# EAGLE design M307A (EAGLE 6.6.0)
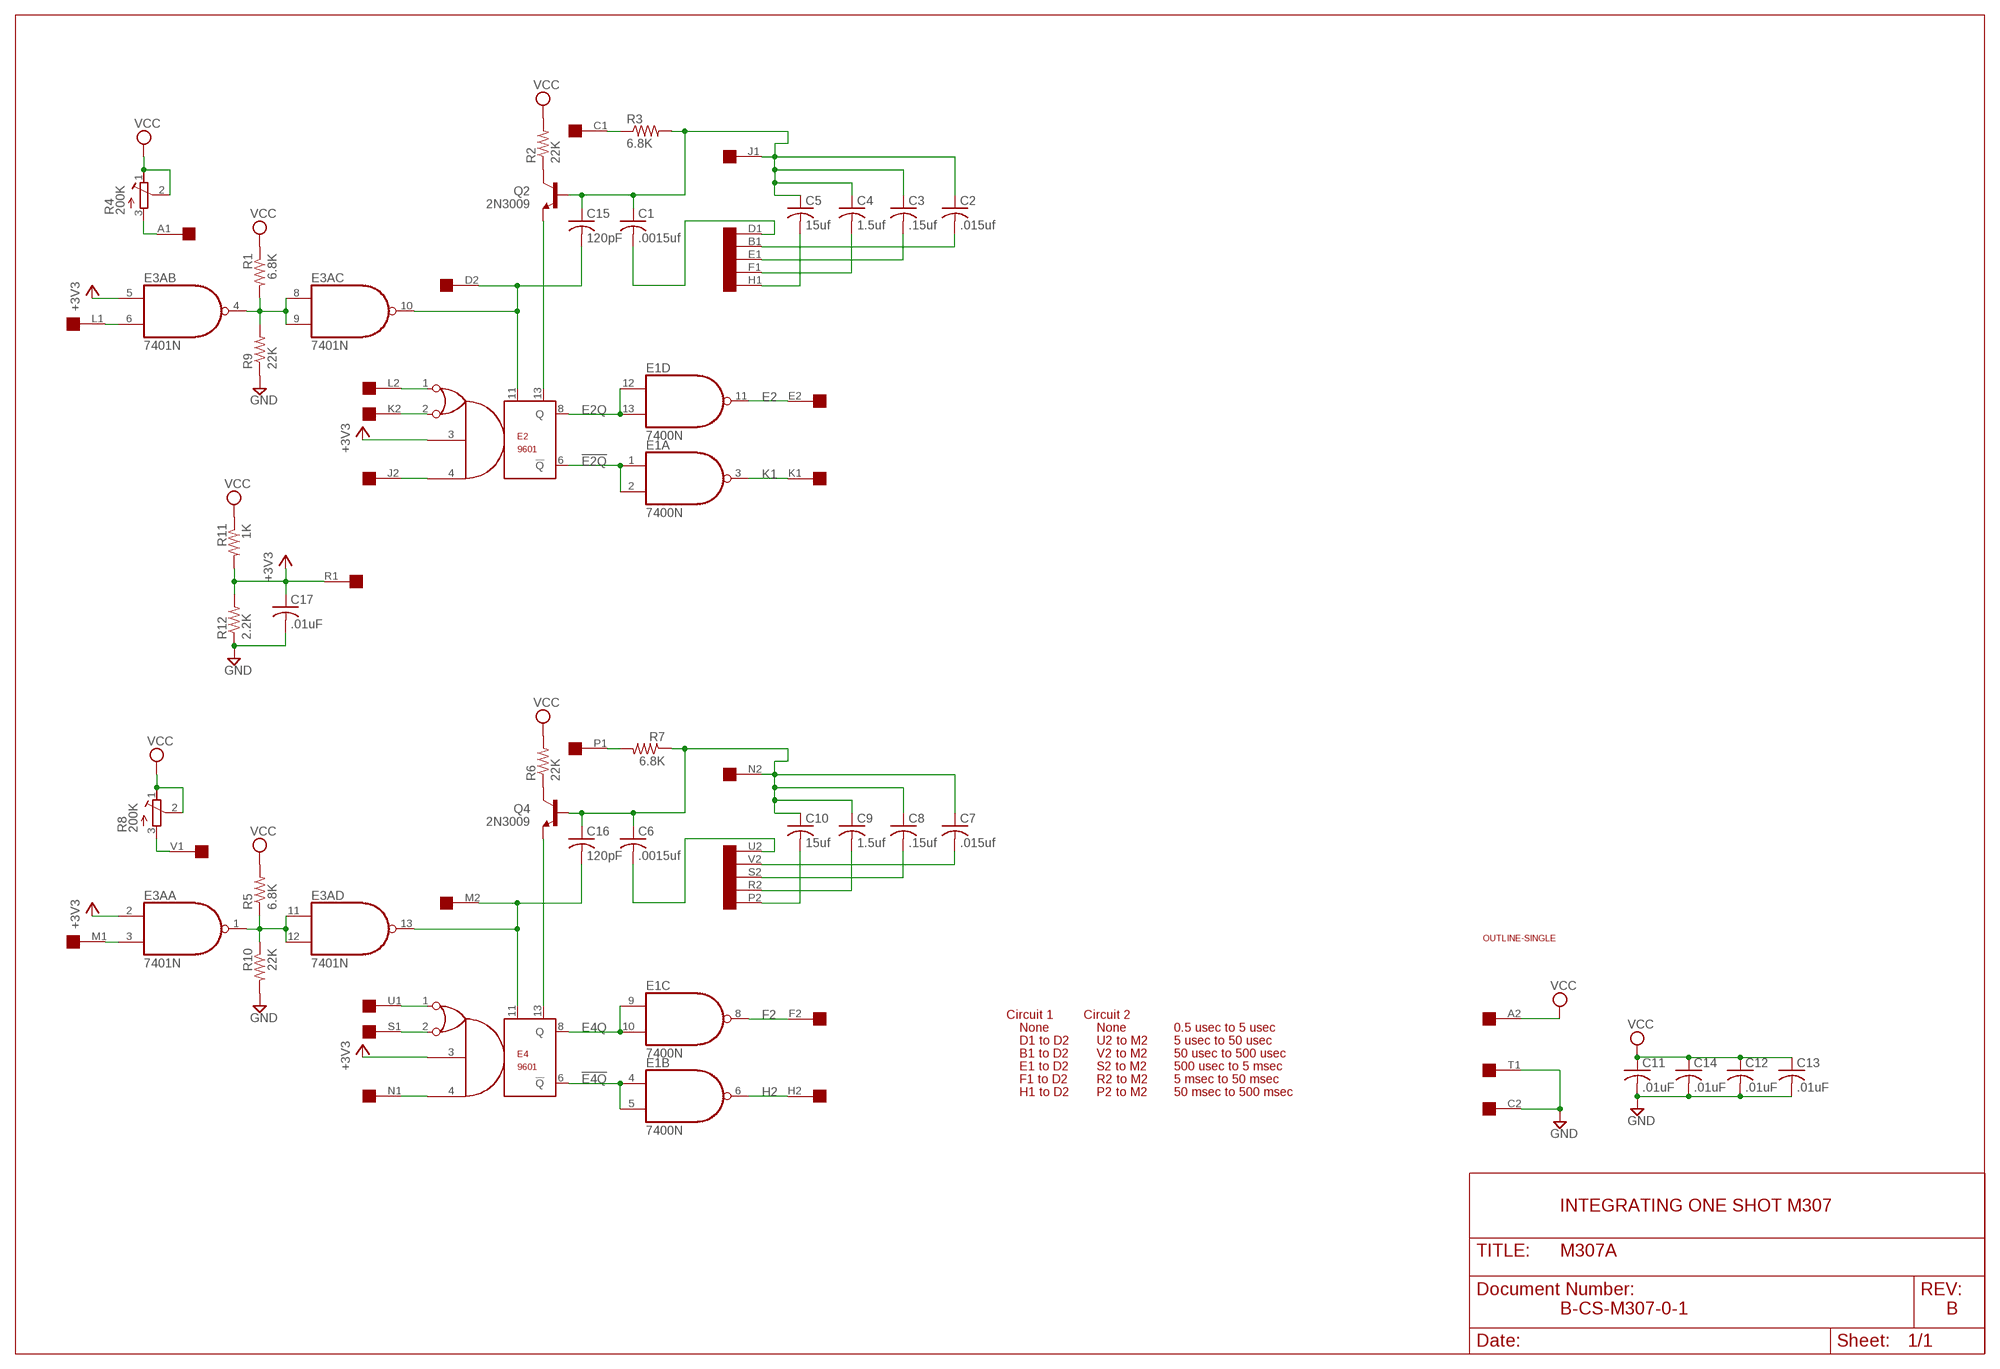
[diagram p0: schematic, sheet 1]

## Parts
C1  .0015uf  C-US050-025X075  [C050-025X075]
C2  .015uf  C-US150-054X183  [C150-054X183]
C3  .15uf  C-US102-054X133  [C102-054X133]
C4  1.5uf  C-US150-054X183  [C150-054X183]
C5  15uf  C-US150-054X183  [C150-054X183]
C6  .0015uf  C-US050-025X075  [C050-025X075]
C7  .015uf  C-US150-054X183  [C150-054X183]
C8  .15uf  C-US102-054X133  [C102-054X133]
C9  1.5uf  C-US150-054X183  [C150-054X183]
C10  15uf  C-US150-054X183  [C150-054X183]
C11  .01uF  C-US050-025X075  [C050-025X075]
C12  .01uF  C-US050-025X075  [C050-025X075]
C13  .01uF  C-US050-025X075  [C050-025X075]
C14  .01uF  C-US050-025X075  [C050-025X075]
C15  120pF  C-US050-025X075  [C050-025X075]
C16  120pF  C-US050-025X075  [C050-025X075]
C17  .01uF  C-US050-025X075  [C050-025X075]
E1  7400N  [DIL14]
E2  9601  [DIL14]
E3A  7401N  74LS01N  [DIL14]
E4  9601  [DIL14]
Q2  2N3009  2N3019-NPN-TO39-EBC  [TO39]
Q4  2N3009  2N3019-NPN-TO39-EBC  [TO39]
R1  6.8K  R-US_0207/10  [0207/10]
R2  22K  R-US_0207/10  [0207/10]
R3  6.8K  R-US_0207/10  [0207/10]
R4  200K  275P  [3006Y]
R5  6.8K  R-US_0207/10  [0207/10]
R6  22K  R-US_0207/10  [0207/10]
R7  6.8K  R-US_0207/10  [0207/10]
R8  200K  275P  [3006Y]
R9  22K  R-US_0207/10  [0207/10]
R10  22K  R-US_0207/10  [0207/10]
R11  1K  R-US_0207/10  [0207/10]
R12  2.2K  R-US_0207/10  [0207/10]
U$1  OUTLINE-SINGLE  [SINGLE]
U$4  SINGLE  [EDGE-CON2]

## Nets
!E2Q: E1.1(A:I0) E1.2(A:I1) E2.6(!Q)
!E4Q: E1.4(B:I0) E1.5(B:I1) E4.6(!Q)
+3V3: C17.1 E2.3 E3A.2(A:I0) E3A.5(B:I0) E4.3 R11.2 R12.2 U$4.R1
A1: R8.3(E) U$4.V1
C1: R3.1 U$4.C1
E2: E1.11(D:O) U$4.E2
E2Q: E1.12(D:I0) E1.13(D:I1) E2.8(Q)
E4Q: E1.9(C:I0) E1.10(C:I1) E4.8(Q)
F2: E1.8(C:O) U$4.F2
GND [power]: C11.2 C12.2 C13.2 C14.2 C17.2 R9.1 R10.2 R12.1 U$4.C2 U$4.T1
H2: E1.6(B:O) U$4.H2
J1: E3A.1(A:O) E3A.11(D:I0) E3A.12(D:I1) R5.1 R10.1
J2: E2.4 U$4.J2
K1: E1.3(A:O) U$4.K1
K2: E2.2 U$4.K2
L1: E3A.6(B:I1) U$4.L1
L2: E2.1 U$4.L2
M1: E3A.3(A:I1) U$4.M1
N1: E4.4 U$4.N1
N$1: E4.13 Q4.1(E)
N$2: E3A.4(B:O) E3A.8(C:I0) E3A.9(C:I1) R1.2 R9.2
N$4: C1.1 C2.1 C3.1 C4.1 C5.1 C15.1 Q2.2(B) R3.2 U$4.J1
N$5: C6.2 U$4.U2
N$6: C15.2 E2.11 E3A.10(C:O) U$4.D2
N$7: C16.2 E3A.13(D:O) E4.11 U$4.M2
N$9: C2.2 U$4.B1
N$10: C3.2 U$4.E1
N$11: C4.2 U$4.F1
N$12: C5.2 U$4.H1
N$13: C6.1 C7.1 C8.1 C9.1 C10.1 C16.1 Q4.2(B) R7.1 U$4.N2
N$17: C10.2 U$4.P2
N$18: C9.2 U$4.R2
N$19: C8.2 U$4.S2
N$20: C7.2 U$4.V2
N$22: C1.2 U$4.D1
N$25: E2.13 Q2.1(E)
N$26: Q2.3(C) R2.1
N$28: Q4.3(C) R6.1
P1: R7.2 U$4.P1
S1: E4.2 U$4.S1
U1: E4.1 U$4.U1
V1: R4.3(E) U$4.A1
VCC [power]: C11.1 C12.1 C13.1 C14.1 R1.1 R2.2 R4.1(A) R4.2(S) R5.2 R6.2 R8.1(A) R8.2(S) R11.1 U$4.A2
Unconnected: U$4.B2 U$4.T2

## Notes on the sheet
- Circuit 1 | Circuit 2
- None | None | 0.5 usec to 5 usec
- D1 to D2 | U2 to M2 | 5 usec to 50 usec
- B1 to D2 | V2 to M2 | 50 usec to 500 usec
- E1 to D2 | S2 to M2 | 500 usec to 5 msec
- F1 to D2 | R2 to M2 | 5 msec to 50 msec
- H1 to D2 | P2 to M2 | 50 msec to 500 msec
- INTEGRATING ONE SHOT M307
- B-CS-M307-0-1 | B

## Power pins joined to a net without a drawn wire
GND: E1.7(P:GND) E2.7(GND) E3A.7(P:GND) E4.7(GND)
VCC: E1.14(P:VCC) E2.14(VCC) E3A.14(P:VCC) E4.14(VCC)

## Library data of the parts
C1-C17 = rcl:C-US: CAPACITOR, American symbol
E1 = 74xx-us:74*00: Quad 2-input NAND gate
E2 E4 = dec-con:9601: DEC9601 monstable
E3A = 74xx-us:74*01: Quad 2-input NAND gate, open collector
Q2 Q4 = transistor:*-NPN-: NPN Transistror BF959 corrected 2008.03.06
R1-R3 R5-R7 R9-R12 = rcl:R-US_: RESISTOR, American symbol
R4 R8 = dec-con:275P: Trimpot with 275P (3006Y) footprint.
U$1 = dec-con:OUTLINE-*: Board outlines for DEC boards.
U$4 = dec-con:SINGLE: Single-Height DEC board

## Net classes
1 power: width 0.813 mm

## Board
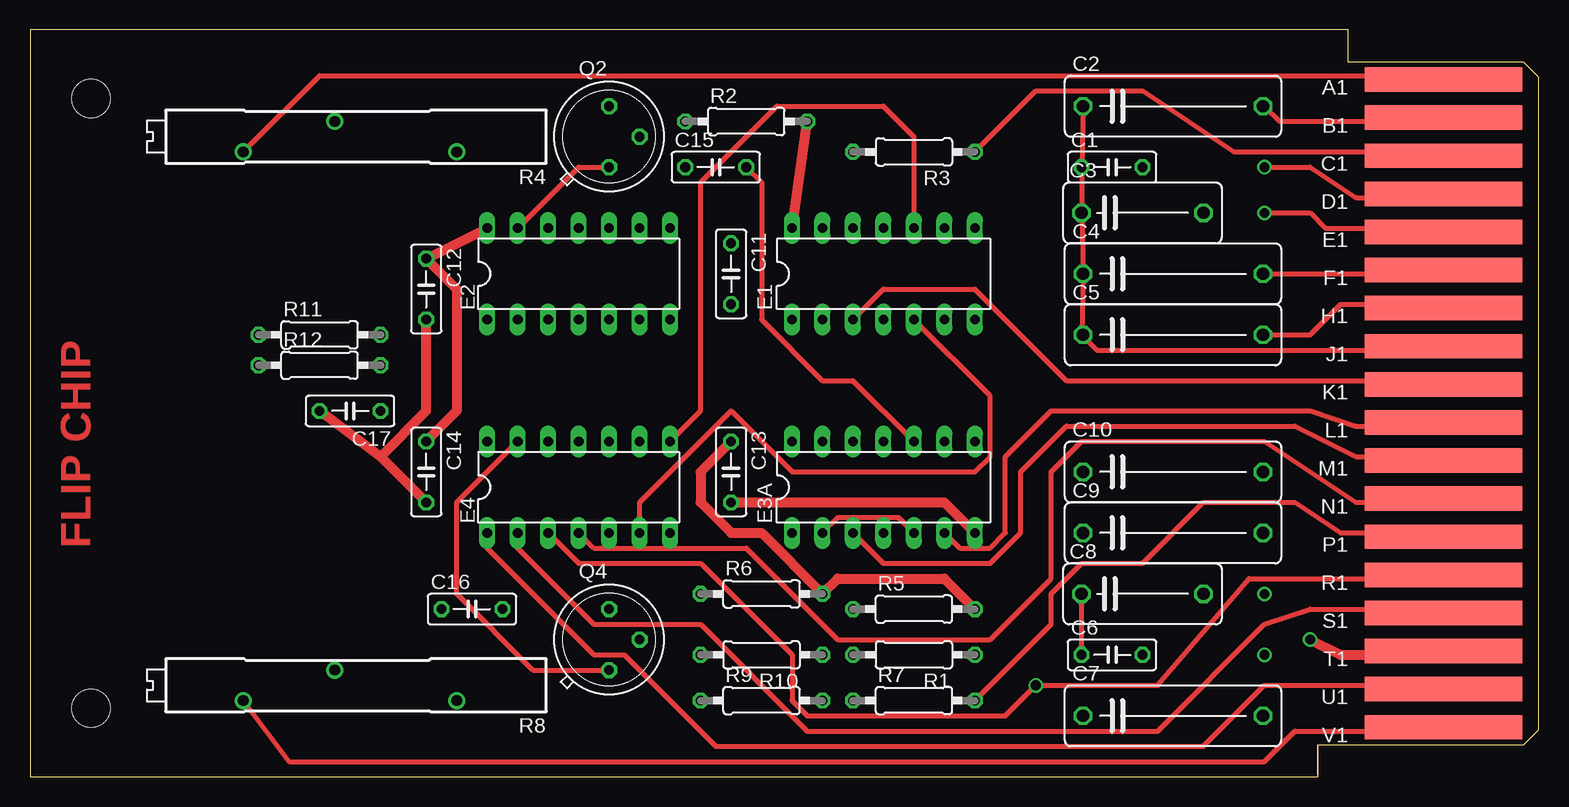
[diagram p1: board, top side]
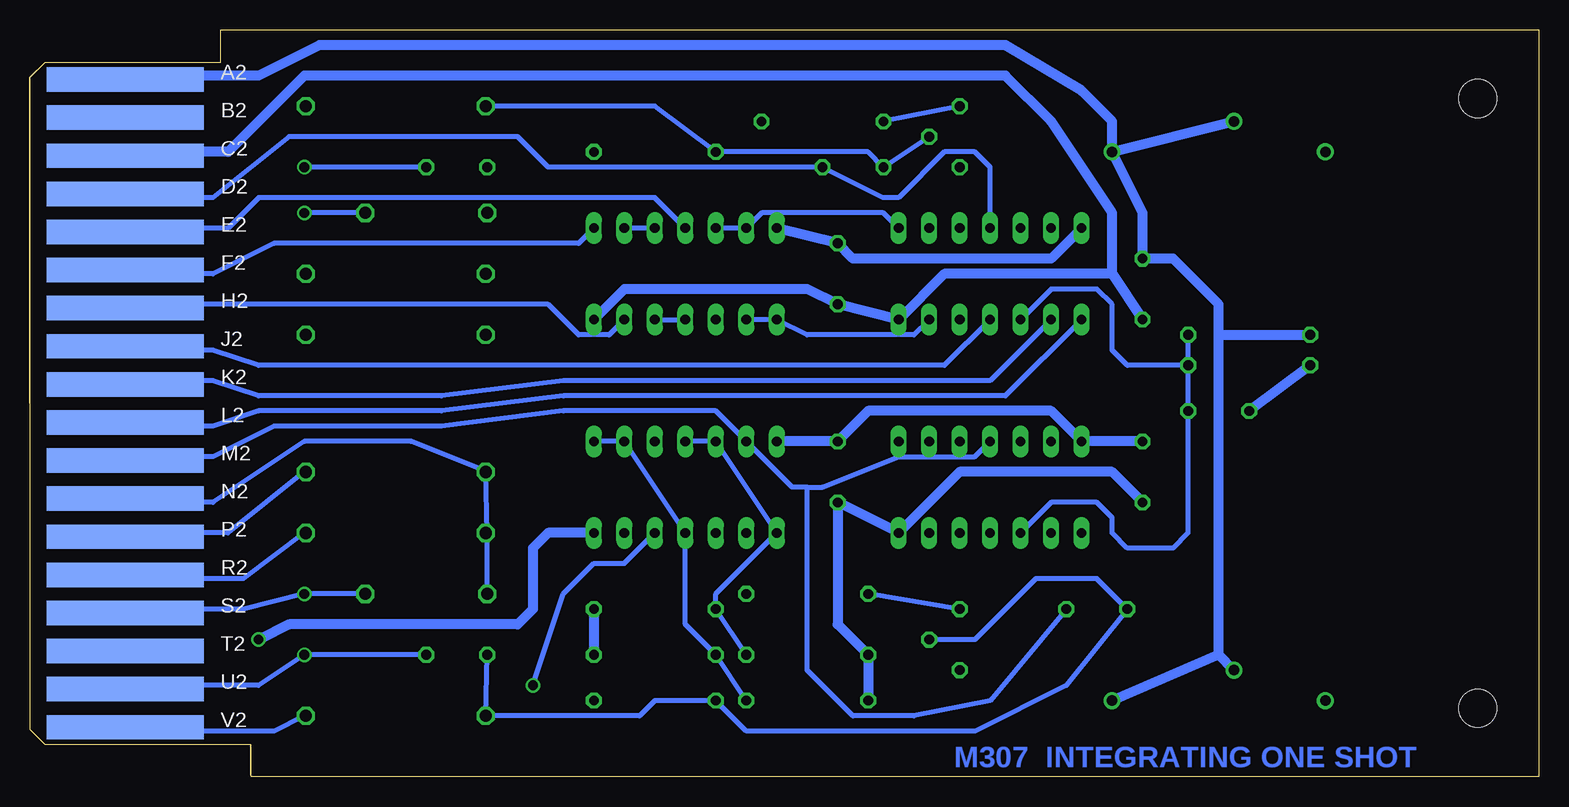
[diagram p2: board, bottom side, seen from below]

Size 125.73 x 62.23 mm. Coordinates in mm from the lower left corner, seen from the top.
Copper layers (1+16): Top 0.035mm / dielectric 1.5mm / Bottom 0.035mm
Design rules "16mils": minimum track width 16mil, minimum drill 32mil, track to track 15mil, track to pad 10mil, pad to pad 10mil, via to via 10mil, smd to smd 10mil, copper to edge 13mil, drill to drill 10mil, minimum pad ring 10mil, minimum via ring 8mil, stop-mask expansion 0mil, vias tented up to drill 0mil, thermal gap 10mil

### Footprints (pad centres in the part's own frame; a part is rotated, then mirrored left to right if it is on the bottom)
C050-025X075 = drill 0.813 octagon: 1 -2.54,0; 2 2.54,0
C150-054X183 = drill 1.016 octagon: 1 -7.493,0; 2 7.493,0
C102-054X133 = drill 1.016 octagon: 1 -5.08,0; 2 5.08,0
DIL14 = drill 0.813 long: 1 -7.62,-3.81; 2 -5.08,-3.81; 3 -2.54,-3.81; 4 0,-3.81; 5 2.54,-3.81; 6 5.08,-3.81; 7 7.62,-3.81; 8 7.62,3.81; 9 5.08,3.81; 10 2.54,3.81; 11 0,3.81; 12 -2.54,3.81; 13 -5.08,3.81; 14 -7.62,3.81
TO39 = drill 0.813 octagon: 1 0,-2.54; 2 2.54,0; 3 0,2.54
0207/10 = drill 0.813 octagon: 1 -5.08,0; 2 5.08,0
3006Y = drill 0.9: 1 -8.89,1.27; 2 1.27,-1.27; 3 8.89,1.27
SINGLE = hole 3.175: 120.65,56.515; 120.65,5.715
EDGE-CON2 = smd 13.106 x 2.032: A1 7.938,4.128; B1 7.938,7.303; C1 7.938,10.477; D1 7.938,13.652; E1 7.938,16.828; F1 7.938,20.003; H1 7.938,23.177; J1 7.938,26.352; K1 7.938,29.527; L1 7.938,32.703; M1 7.938,35.877; N1 7.938,39.053; P1 7.938,42.227; R1 7.938,45.403; S1 7.938,48.578; T1 7.938,51.752; U1 7.938,54.928; V1 7.938,58.102 | smd 13.106 x 2.032 bottom: A2 7.938,4.128; B2 7.938,7.303; C2 7.938,10.477; D2 7.938,13.652; E2 7.938,16.828; F2 7.938,20.003; H2 7.938,23.177; J2 7.938,26.352; K2 7.938,29.527; L2 7.938,32.703; M2 7.938,35.877; N2 7.938,39.053; P2 7.938,42.227; R2 7.938,45.403; S2 7.938,48.578; T2 7.938,51.752; U2 7.938,54.928; V2 7.938,58.102

### Placement (x,y rotation side)
C1  90.17,50.8 0 top
C2  95.25,55.88 0 top
C3  92.71,46.99 0 top
C4  95.25,41.91 0 top
C5  95.25,36.83 0 top
C6  90.17,10.16 0 top
C7  95.25,5.08 0 top
C8  92.71,15.24 0 top
C9  95.25,20.32 0 top
C10  95.25,25.4 0 top
C11  58.42,41.91 270 top
C12  33.02,40.64 270 top
C13  58.42,25.4 270 top
C14  33.02,25.4 270 top
C15  57.15,50.8 0 top
C16  36.83,13.97 0 top
C17  26.67,30.48 180 top
E1  71.12,41.91 0 top
E2  45.72,41.91 0 top
E3A  71.12,24.13 0 top
E4  45.72,24.13 0 top
Q2  48.26,53.34 0 top
Q4  48.26,11.43 0 top
R1  73.66,10.16 180 top
R2  59.69,54.61 0 top
R3  73.66,52.07 180 top
R4  26.67,53.34 180 top
R5  73.66,13.97 0 top
R6  60.96,15.24 0 top
R7  73.66,6.35 0 top
R8  26.67,7.62 180 top
R9  60.96,6.35 0 top
R10  60.96,10.16 180 top
R11  24.13,36.83 0 top
R12  24.13,34.29 0 top
U$1  125.73,62.23 180 top
U$3  [FLIPCHIP]  0,0 0 top
U$4  125.73,62.23 180 top

### Tracks (layer width: path | path; a pad name or v marks a point on that pad's centre or on a via)
!E2Q
  Bottom 0.406: E2.6 52.07,36.83 60.96,36.83 E1.1 E1.2
!E4Q
  Top 0.406: E1.5 80.01,31.75 80.01,26.67 78.74,25.4 63.5,25.4 58.42,30.48 50.8,22.86 E4.6
  Bottom 0.406: E1.5 E1.4
+3V3  (via drill 0.81)
  Top 0.406: E4.3 45.72,17.78 55.88,17.78 63.5,10.16 63.5,6.35 64.77,5.08 81.28,5.08 v83.82,7.62 93.98,7.62 101.6,16.51 116.84,16.51 U$4.R1 | E3A.2 67.31,21.59 72.39,21.59 E3A.5
  Bottom 0.406: R12.2 R11.2 | R12.2 C17.1 29.21,20.32 30.48,19.05 34.29,19.05 35.56,20.32 35.56,21.59 36.83,22.86 40.64,22.86 E4.3 | R12.2 34.29,34.29 35.56,35.56 35.56,39.37 36.83,40.64 40.64,40.64 E2.3 | E3A.5 76.2,17.78 78.74,17.78 81.28,15.24 v83.82,7.62
A1
  Top 0.406: U$4.V1 116.84,3.81 105.41,3.81 102.87,1.27 21.59,1.27 R8.3
C1
  Top 0.406: U$4.C1 116.84,52.07 100.33,52.07 92.71,57.15 83.82,57.15 R3.1
E2
  Bottom 0.406: U$4.E2 116.84,45.72 109.22,45.72 106.68,48.26 73.66,48.26 E1.11
E2Q
  Bottom 0.406: E2.8 54.61,46.99 64.77,46.99 E1.13 E1.12
E4Q
  Top 0.406: E4.8 55.88,30.48 55.88,49.53 62.23,55.88 71.12,55.88 73.66,53.34 E1.10
  Bottom 0.406: E1.10 E1.9
F2
  Bottom 0.406: U$4.F2 116.84,41.91 110.49,41.91 105.41,44.45 80.01,44.45 E1.8
GND  (via drill 0.81)
  Top 0.813: U$4.T1 116.84,10.16 109.22,10.16 v106.68,11.43 | C12.2 33.02,30.48 29.21,26.67 | 29.21,26.67 C14.2 | C17.2 29.21,26.67 | E3A.7 76.2,22.86 C13.2
  Bottom 0.813: U$4.C2 117.17,51.74 116.84,52.07 109.22,52.07 102.87,58.42 44.45,58.42 40.64,54.61 35.56,46.99 35.56,41.91 | C12.2 35.56,41.91 | R12.1 C17.2 | 35.56,41.91 49.53,41.91 E2.7 C11.2 60.96,40.64 76.2,40.64 E1.7 | E3A.7 82.55,20.32 83.82,19.05 83.82,13.97 85.09,12.7 104.14,12.7 v106.68,11.43 | C14.2 35.56,25.4 48.26,25.4 E4.7 C13.2 58.42,12.7 R10.2 R9.1
H2
  Bottom 0.406: E1.6 77.47,36.83 80.01,36.83 82.55,39.37 116.84,39.37 U$4.H2
J1
  Bottom 0.406: R10.1 R5.1 68.58,15.24 E3A.1 E3A.12 E3A.11
J2
  Bottom 0.406: E2.4 49.53,34.29 106.68,34.29 110.49,35.56 116.84,35.56 U$4.J2
K1
  Top 0.406: U$4.K1 116.84,33.02 86.36,33.02 78.74,40.64 71.12,40.64 E1.3
K2
  Bottom 0.406: E2.2 45.72,33.02 81.28,33.02 91.44,31.75 106.68,31.75 110.49,33.02 116.84,33.02 U$4.K2
L1
  Top 0.406: U$4.L1 116.84,29.21 110.49,29.21 106.68,30.48 85.09,30.48 81.28,26.67 81.28,20.32 80.01,19.05 77.47,19.05 E3A.6
L2
  Bottom 0.406: E2.1 44.45,31.75 81.28,31.75 91.44,30.48 106.68,30.48 110.49,29.21 115.57,29.21 U$4.L2
M1
  Top 0.406: E3A.3 71.12,17.78 80.01,17.78 82.55,20.32 82.55,25.4 86.36,29.21 105.41,29.21 110.49,26.67 116.84,26.67 U$4.M1
N1
  Top 0.406: E4.4 46.99,19.05 59.69,19.05 67.31,11.43 80.01,11.43 85.09,16.51 85.09,25.4 87.63,27.94 102.87,27.94 110.49,22.86 116.84,22.86 U$4.N1
N$1
  Top 0.406: Q4.1 41.91,8.89 35.56,15.24 35.56,22.86 E4.13
N$2
  Bottom 0.406: R9.2 R1.2 71.12,12.7 E3A.4 E3A.9 E3A.8
N$4
  Top 0.406: C2.1 C1.1 C3.1 C4.1 87.63,36.83 | 87.63,36.83 C5.1 | U$4.J1 116.84,35.56 88.9,35.56 87.63,36.83
  Bottom 0.406: C2.1 73.66,55.88 R3.2 55.88,52.07 C15.1 Q2.2
N$5  (via drill 0.81)
  Bottom 0.406: U$4.U2 116.84,7.62 106.68,7.62 v102.87,10.16 C6.2
N$6
  Top 0.406: E3A.10 68.58,33.02 66.04,33.02 60.96,38.1 60.96,49.53 C15.2
  Bottom 0.406: U$4.D2 116.84,48.26 110.49,48.26 104.14,53.34 85.09,53.34 82.55,50.8 C15.2 54.61,48.26 53.34,48.26 49.53,52.07 46.99,52.07 45.72,50.8 E2.11
N$7
  Bottom 0.406: U$4.M2 115.57,26.67 110.49,26.67 105.41,29.21 91.44,29.21 81.28,30.48 68.58,30.48 E3A.13 62.23,24.13 60.96,24.13 | C16.2 45.72,6.35 52.07,5.08 57.15,5.08 60.96,8.89 60.96,24.13 | E4.11 46.99,26.67 53.34,26.67 59.69,24.13 60.96,24.13
N$9
  Top 0.406: U$4.B1 116.84,54.61 104.14,54.61 102.87,55.88 C2.2
N$10  (via drill 0.81)
  Top 0.406: v102.87,46.99 106.68,46.99 107.95,45.72 116.84,45.72 U$4.E1
  Bottom 0.406: C3.2 v102.87,46.99
N$11
  Top 0.406: U$4.F1 116.84,41.91 C4.2
N$12
  Top 0.406: U$4.H1 116.84,39.37 109.22,39.37 106.68,36.83 C5.2
N$13
  Top 0.406: C6.1 C8.1
  Bottom 0.406: C6.1 C7.1 74.93,5.08 73.66,6.35 R7.1 66.04,3.81 46.99,3.81 39.37,7.62 C16.1 36.83,16.51 41.91,16.51 46.99,11.43 Q4.2 | 87.63,20.32 C9.1 | C8.1 87.63,20.32 | 87.63,20.32 C10.1 87.63,25.4 93.98,27.94 102.87,27.94 110.49,22.86 116.84,22.86 U$4.N2
N$17
  Bottom 0.406: U$4.P2 116.84,20.32 109.22,20.32 102.87,25.4 C10.2
N$18
  Bottom 0.406: U$4.R2 116.84,16.51 107.95,16.51 102.87,20.32 C9.2
N$19  (via drill 0.81)
  Bottom 0.406: U$4.S2 116.84,13.97 107.95,13.97 v102.87,15.24 C8.2
N$20
  Bottom 0.406: U$4.V2 116.84,3.81 105.41,3.81 102.87,5.08 C7.2
N$22  (via drill 0.81)
  Top 0.406: U$4.D1 116.84,48.26 110.49,48.26 106.68,50.8 v102.87,50.8
  Bottom 0.406: C1.2 v102.87,50.8
N$25
  Top 0.406: Q2.1 45.72,50.8 E2.13
N$26
  Bottom 0.406: Q2.3 R2.1
N$28
  Bottom 0.406: Q4.3 R6.1
P1
  Top 0.406: U$4.P1 116.84,20.32 109.22,20.32 105.41,22.86 97.79,22.86 92.71,17.78 87.63,17.78 85.09,15.24 85.09,12.7 R7.2
S1
  Top 0.406: E4.2 40.64,19.05 46.99,12.7 55.88,12.7 64.77,3.81 93.98,3.81 102.87,12.7 106.68,13.97 116.84,13.97 U$4.S1
U1
  Top 0.406: E4.1 38.1,19.05 46.99,10.16 49.53,10.16 57.15,2.54 97.79,2.54 102.87,7.62 116.84,7.62 U$4.U1
V1
  Top 0.406: U$4.A1 116.84,58.42 24.13,58.42 R4.3
VCC
  Top 0.813: E2.14 C12.1 35.56,40.64 35.56,30.48 C14.1 | E1.14 R2.2 | R5.2 76.2,16.51 67.31,16.51 R6.2 60.96,20.32 58.42,20.32 55.88,22.86 55.88,25.4 C13.1
  Bottom 0.813: U$4.A2 117.24,58.02 116.84,58.42 106.68,58.42 101.6,60.96 44.45,60.96 38.1,57.15 35.56,54.61 R4.1 | R4.1 R4.2 | R4.1 33.02,46.99 C12.1 30.48,43.18 26.67,39.37 26.67,36.83 | 26.67,36.83 R11.1 | R8.2 26.67,10.16 | 26.67,10.16 26.67,36.83 | E2.14 40.64,43.18 57.15,43.18 C11.1 E1.14 | 26.67,10.16 R8.1 | C14.1 E4.14 40.64,30.48 55.88,30.48 C13.1 E3A.14 | R5.2 R1.1

### Text on the board
Bottom: M307 INTEGRATING ONE SHOT